# EAGLE design Feather-RTD (EAGLE 9.0.0)
LICENSE: CC BY-SA 4.0; REV: XTMT; TITLE: Feather RTD Wing; URL: https://github.com/CapableRobot/Feather-RTD

## Sheet 1 of 3
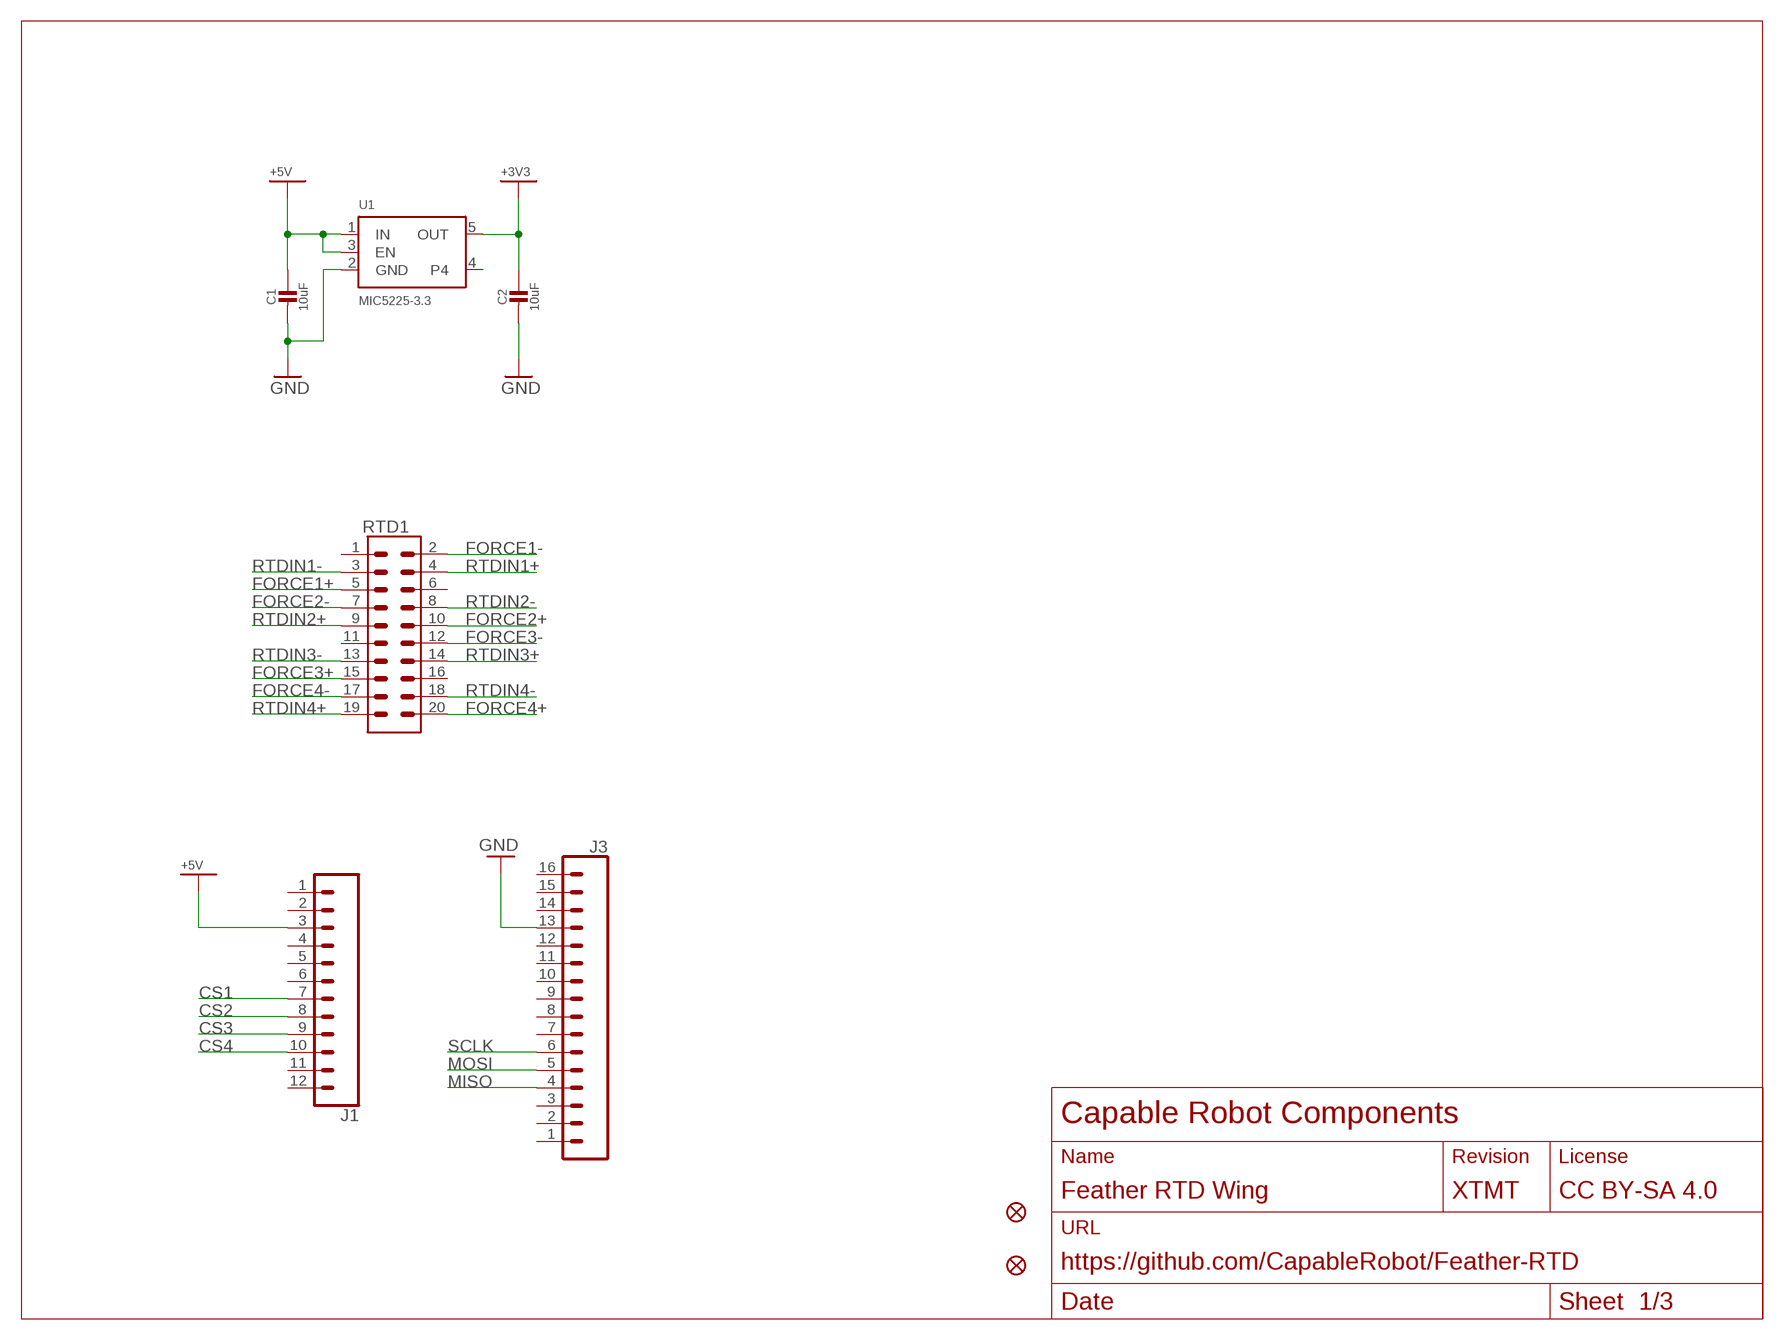
[diagram p0: schematic, sheet 1]

### Parts
C1  10uF  CAP_CERAMIC0805-NOOUTLINE  [0805-NO]
C2  10uF  CAP_CERAMIC0805-NOOUTLINE  [0805-NO]
FID1  FIDUCIAL""  [FIDUCIAL_1MM]
FID2  FIDUCIAL""  [FIDUCIAL_1MM]
J1  CONN_12NO_SILK  [1X12_NO_SILK]
J3  CONN_161X16_NO_SILK  [1X16_NO_SILK]
RTD1  CONN-20  [CONN-2X10-050-SMT-ZT]
U1  MIC5225-3.3  VREG_SOT23-5  [SOT23-5]

### Nets
+3V3: C2.1 U1.5(OUT) ; also sheet 2,3
+5V: C1.1 J1.3 U1.1(IN) U1.3(EN)
CS1: J1.7 ; also sheet 2
CS2: J1.8 ; also sheet 2
CS3: J1.9 ; also sheet 3
CS4: J1.10 ; also sheet 3
FORCE1+: RTD1.5 ; also sheet 2
FORCE1-: RTD1.2 ; also sheet 2
FORCE2+: RTD1.10 ; also sheet 2
FORCE2-: RTD1.7 ; also sheet 2
FORCE3+: RTD1.15 ; also sheet 3
FORCE3-: RTD1.12 ; also sheet 3
FORCE4+: RTD1.20 ; also sheet 3
FORCE4-: RTD1.17 ; also sheet 3
GND: C1.2 C2.2 J3.13 U1.2(GND) ; also sheet 2,3
MISO: J3.4 ; also sheet 2,3
MOSI: J3.5 ; also sheet 2,3
RTDIN1+: RTD1.4 ; also sheet 2
RTDIN1-: RTD1.3 ; also sheet 2
RTDIN2+: RTD1.9 ; also sheet 2
RTDIN2-: RTD1.8 ; also sheet 2
RTDIN3+: RTD1.14 ; also sheet 3
RTDIN3-: RTD1.13 ; also sheet 3
RTDIN4+: RTD1.19 ; also sheet 3
RTDIN4-: RTD1.18 ; also sheet 3
SCLK: J3.6 ; also sheet 2,3
Unconnected: J1.1 J1.2 J1.4 J1.5 J1.6 J1.11 J1.12 J3.1 J3.2 J3.3 J3.7 J3.8 J3.9 J3.10 J3.11 J3.12 J3.14 J3.15 J3.16 RTD1.1 RTD1.6 RTD1.11 RTD1.16 U1.4

## Sheet 2 of 3
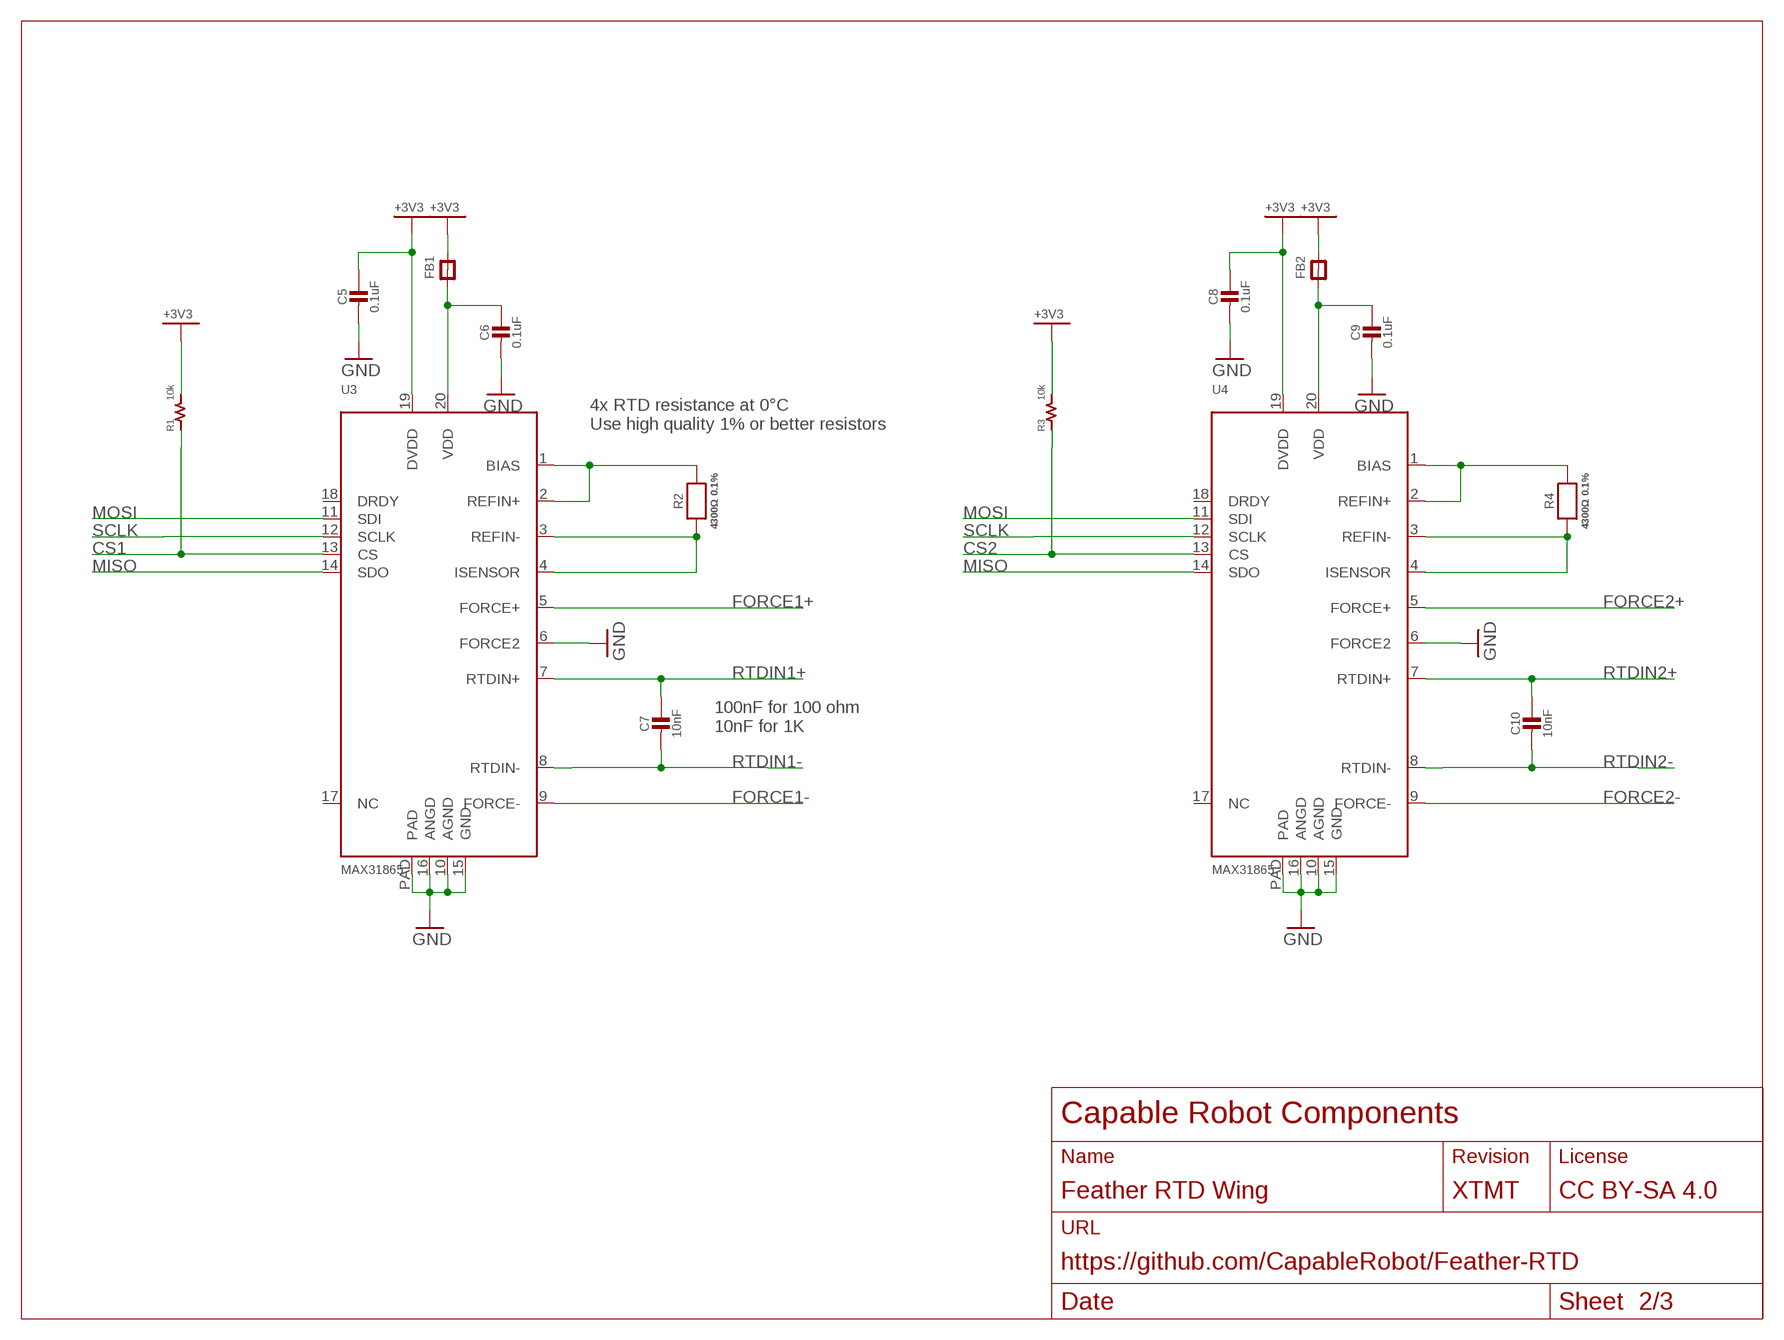
[diagram p1: schematic, sheet 2]

### Parts
C5  0.1uF  CAP_CERAMIC0805-NOOUTLINE  [0805-NO]
C6  0.1uF  CAP_CERAMIC0805-NOOUTLINE  [0805-NO]
C7  10nF  CAP_CERAMIC0805-NOOUTLINE  [0805-NO]
C8  0.1uF  CAP_CERAMIC0805-NOOUTLINE  [0805-NO]
C9  0.1uF  CAP_CERAMIC0805-NOOUTLINE  [0805-NO]
C10  10nF  CAP_CERAMIC0805-NOOUTLINE  [0805-NO]
FB1  FERRITE-0805NO  [0805-NO]
FB2  FERRITE-0805NO  [0805-NO]
R1  10k  RES0603  [0603]
R2  4300Ω 0.1%  RESISTOR0805_NOOUTLINE  [0805-NO]
R3  10k  RES0603  [0603]
R4  4300Ω 0.1%  RESISTOR0805_NOOUTLINE  [0805-NO]
U3  MAX31865  TEMP_MAX31865  [QFN20_4MM_0.65MM]
U4  MAX31865  TEMP_MAX31865  [QFN20_4MM_0.65MM]

### Nets
+3V3: C5.1 C8.1 FB1.2 FB2.2 R1.2 R3.2 U3.19(DVDD) U4.19(DVDD) ; also sheet 1,3
CS1: R1.1 U3.13(CS) ; also sheet 1
CS2: R3.1 U4.13(CS) ; also sheet 1
FORCE1+: U3.5(FORCE+) ; also sheet 1
FORCE1-: U3.9(FORCE-) ; also sheet 1
FORCE2+: U4.5(FORCE+) ; also sheet 1
FORCE2-: U4.9(FORCE-) ; also sheet 1
GND: C5.2 C6.2 C8.2 C9.2 U3.6(FORCE2) U3.10(AGND) U3.15(GND) U3.16(ANGD) U3.PAD U4.6(FORCE2) U4.10(AGND) U4.15(GND) U4.16(ANGD) U4.PAD ; also sheet 1,3
MISO: U3.14(SDO) U4.14(SDO) ; also sheet 1,3
MOSI: U3.11(SDI) U4.11(SDI) ; also sheet 1,3
N$5: R2.2 U3.1(BIAS) U3.2(REFIN+)
N$6: R2.1 U3.3(REFIN-) U3.4(ISENSOR)
N$7: C6.1 FB1.1 U3.20(VDD)
N$8: R4.2 U4.1(BIAS) U4.2(REFIN+)
N$9: R4.1 U4.3(REFIN-) U4.4(ISENSOR)
N$10: C9.1 FB2.1 U4.20(VDD)
RTDIN1+: C7.1 U3.7(RTDIN+) ; also sheet 1
RTDIN1-: C7.2 U3.8(RTDIN-) ; also sheet 1
RTDIN2+: C10.1 U4.7(RTDIN+) ; also sheet 1
RTDIN2-: C10.2 U4.8(RTDIN-) ; also sheet 1
SCLK: U3.12(SCLK) U4.12(SCLK) ; also sheet 1,3
Unconnected: U3.17(NC) U3.18(DRDY) U4.17(NC) U4.18(DRDY)

### Notes on the sheet
- 4x RTD resistance at 0°C 
  Use high quality 1% or better resistors
- 100nF for 100 ohm
  10nF for 1K

## Sheet 3 of 3
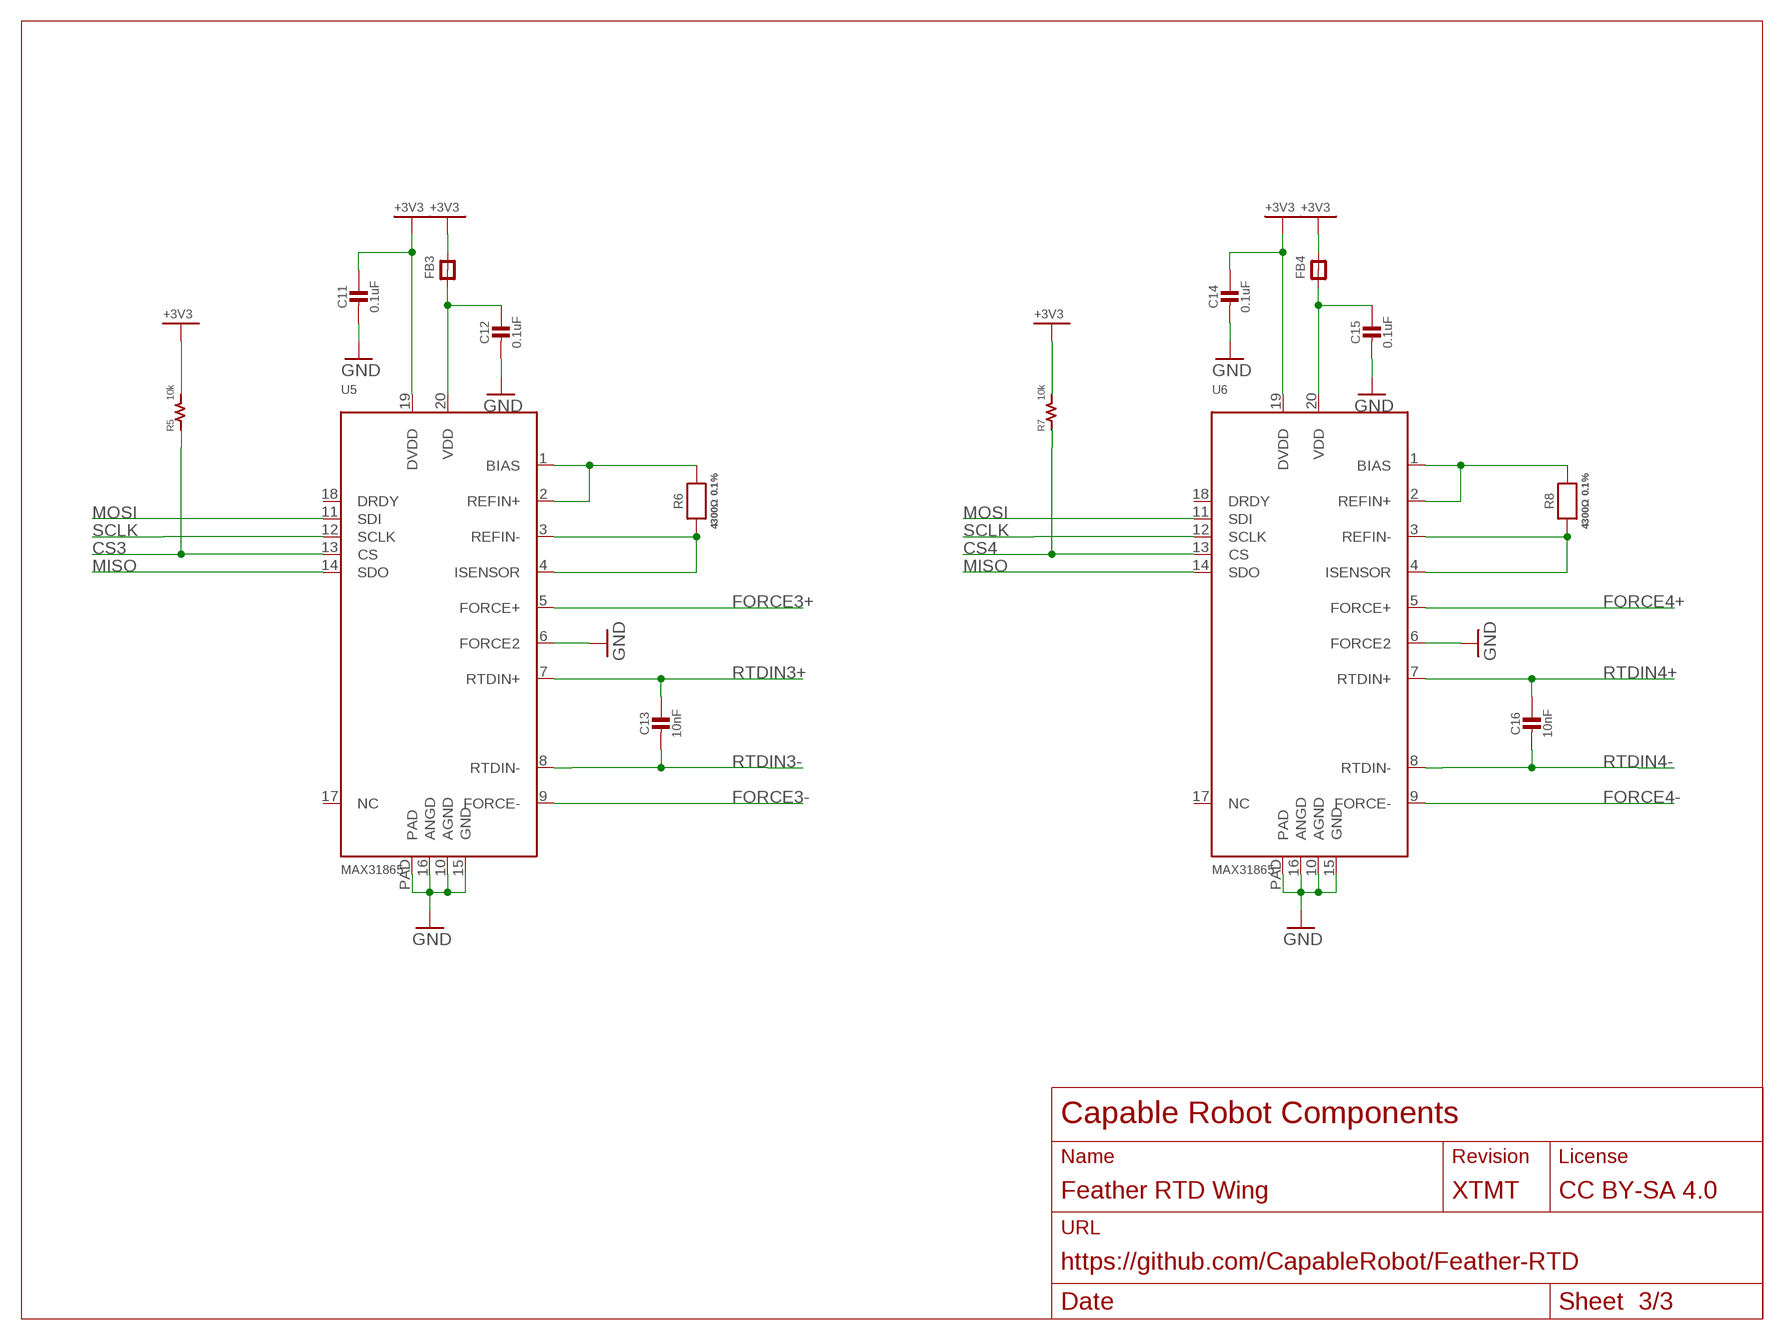
[diagram p2: schematic, sheet 3]

### Parts
C11  0.1uF  CAP_CERAMIC0805-NOOUTLINE  [0805-NO]
C12  0.1uF  CAP_CERAMIC0805-NOOUTLINE  [0805-NO]
C13  10nF  CAP_CERAMIC0805-NOOUTLINE  [0805-NO]
C14  0.1uF  CAP_CERAMIC0805-NOOUTLINE  [0805-NO]
C15  0.1uF  CAP_CERAMIC0805-NOOUTLINE  [0805-NO]
C16  10nF  CAP_CERAMIC0805-NOOUTLINE  [0805-NO]
FB3  FERRITE-0805NO  [0805-NO]
FB4  FERRITE-0805NO  [0805-NO]
R5  10k  RES0603  [0603]
R6  4300Ω 0.1%  RESISTOR0805_NOOUTLINE  [0805-NO]
R7  10k  RES0603  [0603]
R8  4300Ω 0.1%  RESISTOR0805_NOOUTLINE  [0805-NO]
U5  MAX31865  TEMP_MAX31865  [QFN20_4MM_0.65MM]
U6  MAX31865  TEMP_MAX31865  [QFN20_4MM_0.65MM]

### Nets
+3V3: C11.1 C14.1 FB3.2 FB4.2 R5.2 R7.2 U5.19(DVDD) U6.19(DVDD) ; also sheet 1,2
CS3: R5.1 U5.13(CS) ; also sheet 1
CS4: R7.1 U6.13(CS) ; also sheet 1
FORCE3+: U5.5(FORCE+) ; also sheet 1
FORCE3-: U5.9(FORCE-) ; also sheet 1
FORCE4+: U6.5(FORCE+) ; also sheet 1
FORCE4-: U6.9(FORCE-) ; also sheet 1
GND: C11.2 C12.2 C14.2 C15.2 U5.6(FORCE2) U5.10(AGND) U5.15(GND) U5.16(ANGD) U5.PAD U6.6(FORCE2) U6.10(AGND) U6.15(GND) U6.16(ANGD) U6.PAD ; also sheet 1,2
MISO: U5.14(SDO) U6.14(SDO) ; also sheet 1,2
MOSI: U5.11(SDI) U6.11(SDI) ; also sheet 1,2
N$11: R6.2 U5.1(BIAS) U5.2(REFIN+)
N$12: R6.1 U5.3(REFIN-) U5.4(ISENSOR)
N$13: C12.1 FB3.1 U5.20(VDD)
N$14: R8.2 U6.1(BIAS) U6.2(REFIN+)
N$15: R8.1 U6.3(REFIN-) U6.4(ISENSOR)
N$16: C15.1 FB4.1 U6.20(VDD)
RTDIN3+: C13.1 U5.7(RTDIN+) ; also sheet 1
RTDIN3-: C13.2 U5.8(RTDIN-) ; also sheet 1
RTDIN4+: C16.1 U6.7(RTDIN+) ; also sheet 1
RTDIN4-: C16.2 U6.8(RTDIN-) ; also sheet 1
SCLK: U5.12(SCLK) U6.12(SCLK) ; also sheet 1,2
Unconnected: U5.17(NC) U5.18(DRDY) U6.17(NC) U6.18(DRDY)

## Library data of the parts
C1 C2 C5-C16 = microbuilder:CAP_CERAMIC: Ceramic Capacitors For new designs, use the packages preceded by an '_' character since they are more reliable: The following footprints should be used on most boards: _0402 - Standard footprint for regular board layouts _0603 - Standard footprint for regular board layouts _0805 - Standard footprint for regular board layouts _1206 - Standard footprint for regular board layouts For extremely tight-pitch boards where space is at a premium, the following 'micro-pitch' footprints can be used (smaller pads, no silkscreen outline, etc.): _0402MP - Micro-pitch footprint for very dense/compact boards _0603MP - Micro-pitch footprint for very dense/compact boards _0805MP - Micro-pitch footprint for very dense/compact boards _1206MP - Micro-pitch footprint for very dense/compact boards
FB1-FB4 = microbuilder:FERRITE: Ferrite Bead 0603 MMZ1608B121C - 120 Ohm @ 100MHz, 600mA, 0.15 Ohm DC Resistance - Digikey: 445-2164-1-ND BK1608HW121-T - 120 Ohm, 600mA Ferrite Chip - Digikey: 587-1876-2-ND 0805 HZ0805B272R-10 - 2.7K Ohm @ 100MHz, 200mA, 0.8 Ohm DC Resistance - Digikey: 240-2504-1-ND (see also Murata BLM21BD272SN1L) MMZ2012Y152B - 1.5K Ohm @ 100MHz, 500mA, 0.4 Ohm DC Resistance - Digikey: 445-1560-1-ND - Mainly for high frequency (80-400MHz) MMZ2012R102A - 1K Ohm @ 100MHz, 500mA, 0.3 Ohm DC Resistance - Digikey: 445-1555-2-ND - More general purpose (10-200MHz)
FID1 FID2 = microbuilder:FIDUCIAL: Fiducial Alignment Points Various fiducial points for machine vision alignment.; BOM: EXCLUDE
J1 = SparkFun-Connectors:CONN_12: Multi connection point. Often used as Generic Header-pin footprint for 0.1 inch spaced/style header connections On any of the 0.1 inch spaced packages, you can populate with these: Break Away Headers - Straight <https://www.sparkfun.com/products/116> (PRT-00116) Break Away Male Headers - Right Angle <https://www.sparkfun.com/products/553> (PRT-00553) Female Headers <https://www.sparkfun.com/products/115> (PRT-00115) Break Away Headers - Machine Pin <https://www.sparkfun.com/products/117> (PRT-00117) Break Away Female Headers - Swiss Machine Pin <https://www.sparkfun.com/products/743> (PRT-00743) For SCREWTERMINALS and SPRING TERMINALS visit here: Screw Terimnals on SparkFun.com <https://www.sparkfun.com/search/results?term=Screw+Terminals> (5mm/3.5mm/2.54mm spacing) This device is also useful as a general connection point to wire up your design to another part of your project. Our various solder wires solder well into these plated through hole pads. Hook-Up Wire - Assortment (Stranded, 22 AWG) <https://www.sparkfun.com/products/11375> (PRT-11375) Hook-Up Wire - Assortment (Solid Core, 22 AWG) <https://www.sparkfun.com/products/11367> (PRT-11367) View the entire wire category on our website here <https://www.sparkfun.com/categories/141> Special notes: Molex polarized connector foot print use with SKU : PRT-08231 with associated crimp pins and housings. 1MM SMD Version SKU: PRT-10208 NOTES ON THE VARIANTS LOCK and LOCK_LONGPADS... This footprint was designed to help hold the alignment of a through-hole component (i.e. 6-pin header) while soldering it into place. You may notice that each hole has been shifted either up or down by 0.005 of an inch from it's more standard position (which is a perfectly straight line). This slight alteration caused the pins (the squares in the middle) to touch the edges of the holes. Because they are alternating, it causes a "brace" to hold the component in place. 0.005 has proven to be the perfect amount of "off-center" position when using our standard breakaway headers. Although looks a little odd when you look at the bare footprint, once you have a header in there, the alteration is very hard to notice. Also,if you push a header all the way into place, it is covered up entirely on the bottom side.
J3 = SparkFun-Connectors:CONN_16: Multi connection point. Often used as Generic Header-pin footprint for 0.1 inch spaced/style header connections On any of the 0.1 inch spaced packages, you can populate with these: Break Away Headers - Straight <https://www.sparkfun.com/products/116> (PRT-00116) Break Away Male Headers - Right Angle <https://www.sparkfun.com/products/553> (PRT-00553) Female Headers <https://www.sparkfun.com/products/115> (PRT-00115) Break Away Headers - Machine Pin <https://www.sparkfun.com/products/117> (PRT-00117) Break Away Female Headers - Swiss Machine Pin <https://www.sparkfun.com/products/743> (PRT-00743) For SCREWTERMINALS and SPRING TERMINALS visit here: Screw Terimnals on SparkFun.com <https://www.sparkfun.com/search/results?term=Screw+Terminals> (5mm/3.5mm/2.54mm spacing) This device is also useful as a general connection point to wire up your design to another part of your project. Our various solder wires solder well into these plated through hole pads. Hook-Up Wire - Assortment (Stranded, 22 AWG) <https://www.sparkfun.com/products/11375> (PRT-11375) Hook-Up Wire - Assortment (Solid Core, 22 AWG) <https://www.sparkfun.com/products/11367> (PRT-11367) View the entire wire category on our website here <https://www.sparkfun.com/categories/141> Special notes: Molex polarized connector foot print use with SKU : PRT-08231 with associated crimp pins and housings. 1MM SMD Version SKU: PRT-10208 NOTES ON THE VARIANTS LOCK and LOCK_LONGPADS... This footprint was designed to help hold the alignment of a through-hole component (i.e. 6-pin header) while soldering it into place. You may notice that each hole has been shifted either up or down by 0.005 of an inch from it's more standard position (which is a perfectly straight line). This slight alteration caused the pins (the squares in the middle) to touch the edges of the holes. Because they are alternating, it causes a "brace" to hold the component in place. 0.005 has proven to be the perfect amount of "off-center" position when using our standard breakaway headers. Although looks a little odd when you look at the bare footprint, once you have a header in there, the alteration is very hard to notice. Also,if you push a header all the way into place, it is covered up entirely on the bottom side.
R1 R3 R5 R7 = CapableRobot:RES
R2 R4 R6 R8 = microbuilder:RESISTOR: Resistors For new designs, use the packages preceded by an '_' character since they are more reliable: The following footprints should be used on most boards: _0402 - Standard footprint for regular board layouts _0603 - Standard footprint for regular board layouts _0805 - Standard footprint for regular board layouts _1206 - Standard footprint for regular board layouts For extremely tight-pitch boards where space is at a premium, the following 'micro-pitch' footprints can be used (smaller pads, no silkscreen outline, etc.): _0402MP - Micro-pitch footprint for very dense/compact boards _0603MP - Micro-pitch footprint for very dense/compact boards _0805MP - Micro-pitch footprint for very dense/compact boards _1206MP - Micro-pitch footprint for very dense/compact boards
RTD1 = osterwood:CONN-20
U1 = microbuilder:VREG_SOT23-5: SOT23-5 Fixed Voltage Regulators Part Current Out V Out V In V Dropout θJA (°C/W) TJ (°C) Digikey Part No. ADP121 150mA 3.3V 3.4-5.5V 0.09V @ 150mA -- -- ADP121-AUJZ33R7CT-ND ADP121 150mA 3.0V 3.1-5.5V 0.09V @ 150mA -- -- ADP121-AUJZ30R7CT-ND ADP122 300mA 3.3V 3.4-5.5V 0.085V @ 300mA -- -- ADP122AUJZ-3.3-R7CT-ND ADP1712 300mA 3.3V 3.5-5.5V 0.17V @ 300mA -- -- ADP1712AUJZ-3.3-R7TR-ND AP7311 (Low Cost) 150mA 3.3V 3.5-6V 0.15V @ 150mA -- -- AP7311-33WG-7DICT-ND LD39015M18R 150mA 1.8V 1.9V-5.5V 0.08V @ 100mA -- -- 497-6977-1-ND LP2985A-33DBVR 150mA 3.3V 3.3-16V 0.28V @ 150mA 206 150 296-18479-1-ND MCP1824T-3302E/OT 300mA 3.3V 3.5V-6V 0.2V @ 300mA -- -- MCP1824T-3302E/OTCT-ND MIC5205-2.5YM5 TR 150mA 2.5V 2.7-16V 0.165V @ 150mA -- -- 576-1257-2-ND MIC5205-3.0YM5 TR 150mA 3.0V 3.2V-16V 0.165V @ 150mA -- -- 576-1258-2-ND MIC5205-3.3YM5 TR 150mA 3.3V 3.5V-16V 0.165V @ 150mA -- -- 576-1259-2-ND TPS780330220 150mA 3.3V+2.2V 3.6-5.5V 250mV Max -- -- 296-23332-1-ND TDA3663/N1,135 100mA 3.3V 3.5-45V 0.18V @ 50mA -- -- 568-5343-1-ND Max operating temp can be calculated using θJA, TJ (max junction temperature), and power in watts. Set the "Maximum Ambient Temperature" until it reaches TJ ("Max Junction Temperature"), which is the absolute limit for safe use of the regulator: Heat Sink Temperature Calculator <http://www.daycounter.com/Calculators/Heat-Sink-Temperature-Calculator.phtml> For example, With 12V source into a 3.3V LP2985 and a 30mA load, we are dissipating (12V-3.3V) * 0.03A = 0.261W. With a θJA of 206 °C/W, a TJ of 150°C, and 261mW we can safely use the chip without a heat sink up to 75°C (=147.1°C Junction Temperature).
U3-U6 = microbuilder:TEMP_MAX31865: MAX31865 - Resistance to Digital Convertor for Platinum Resistance Temperature Detectors (RTDs) Handles 100 ohm - 1K ohm (at 0°C) platinum RTDs. 15-bit ADC resolution (nominally 0.03125°C), 0.5°C accuracy.

## Board
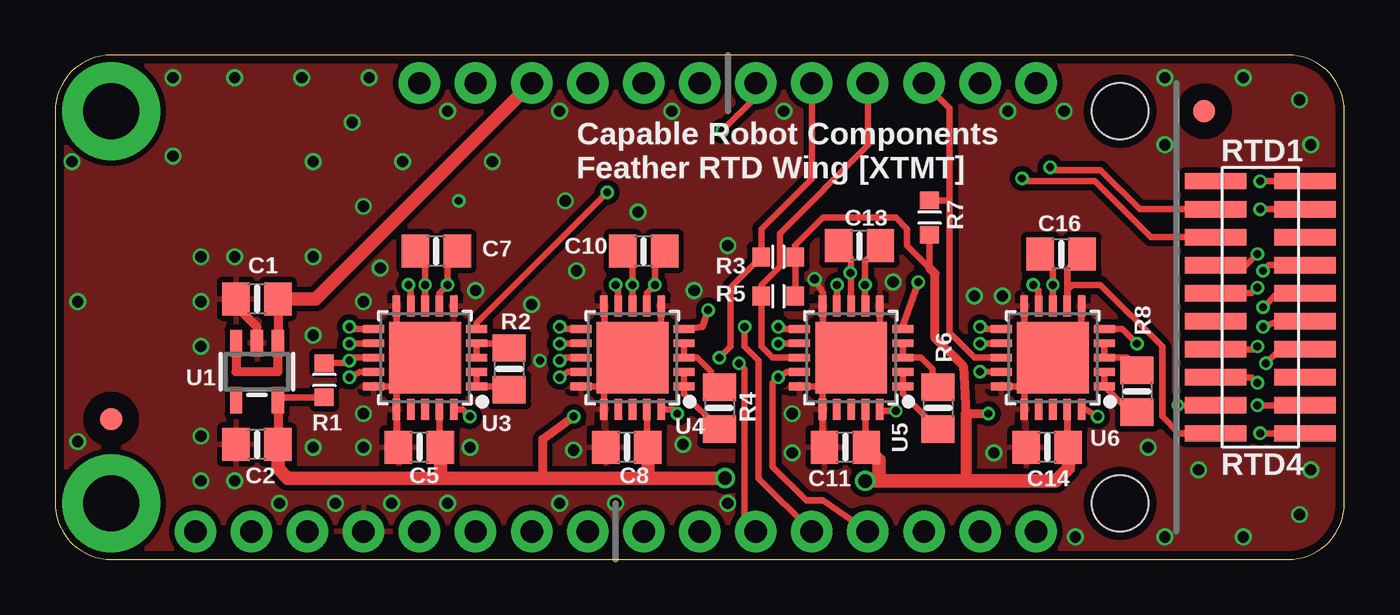
[diagram p3: board, top side]
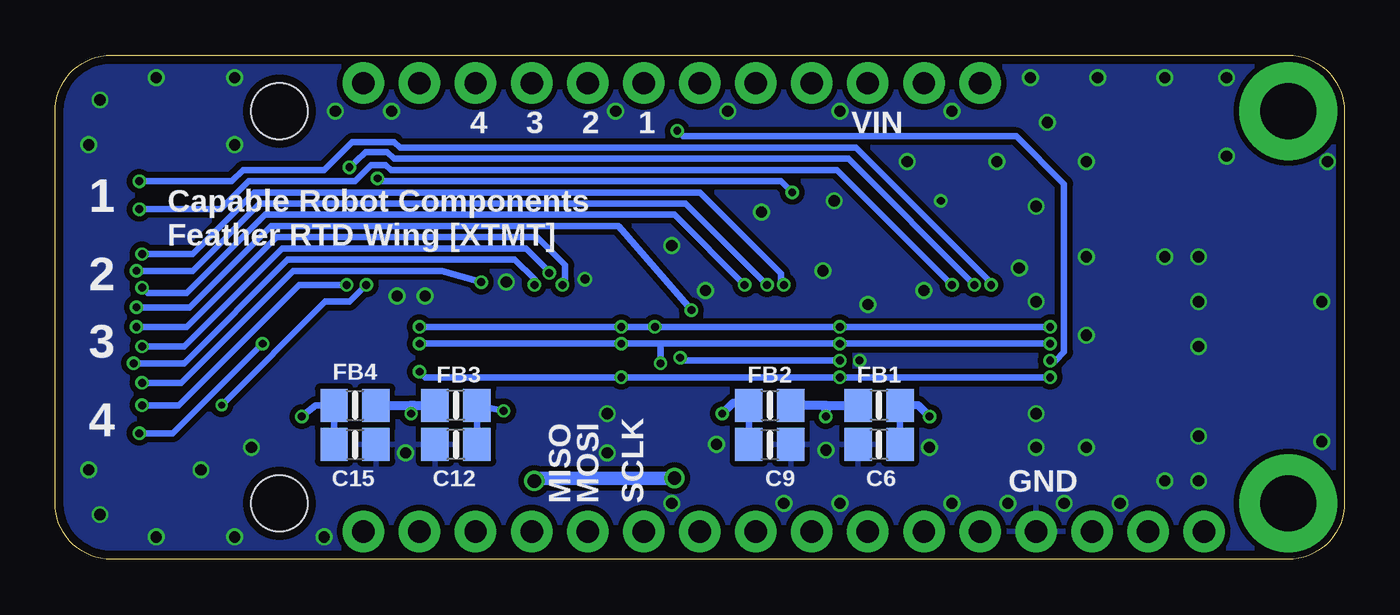
[diagram p4: board, bottom side, seen from below]

Size 58.42 x 22.86 mm. Coordinates in mm from the lower left corner, seen from the top.
Outline: 2.54,0 55.88,0 arc90 58.42,2.54 58.42,20.32 arc90 55.88,22.86 2.54,22.86 arc90 0,20.32 0,2.54 arc90 2.54,0
Copper layers (1*16): Top 0.035559375mm / dielectric 1.6mm / Bottom 0.035559375mm
Design rules "oshpark-2layer-tented *": minimum track width 6mil, minimum drill 10mil, track to track 6mil, track to pad 6mil, pad to pad 6mil, via to via 6mil, smd to smd 6mil, copper to edge 15mil, drill to drill 6mil, minimum pad ring 5mil, minimum via ring 5mil, stop-mask expansion 2.5mil, vias tented up to drill 25mil, thermal gap 10mil
Holes 2.54 mm at 48.26,2.54 48.26,20.32

### Footprints (pad centres in the part's own frame; a part is rotated, then mirrored left to right if it is on the bottom)
0805-NO = smd 1.24 x 1.5: 1 -0.95,0; 2 0.95,0
FIDUCIAL_1MM = smd 1 x 1: 1 0,0
1X12_NO_SILK = drill 1.016 pad 1.88: 1 0,0; 2 2.54,0; 3 5.08,0; 4 7.62,0; 5 10.16,0; 6 12.7,0; 7 15.24,0; 8 17.78,0; 9 20.32,0; 10 22.86,0; 11 25.4,0; 12 27.94,0
1X16_NO_SILK = drill 1.016 pad 1.88: 1 0,0; 2 2.54,0; 3 5.08,0; 4 7.62,0; 5 10.16,0; 6 12.7,0; 7 15.24,0; 8 17.78,0; 9 20.32,0; 10 22.86,0; 11 25.4,0; 12 27.94,0; 13 30.48,0; 14 33.02,0; 15 35.56,0; 16 38.1,0
0603 = smd 0.79 x 0.86: 1 -0.775,0; 2 0.775,0
CONN-2X10-050-SMT-ZT = smd 0.737 x 2.794: 1 5.715,2.032; 2 5.715,-2.032; 3 4.445,2.032; 4 4.445,-2.032; 5 3.175,2.032; 6 3.175,-2.032; 7 1.905,2.032; 8 1.905,-2.032; 9 0.635,2.032; 10 0.635,-2.032; 11 -0.635,2.032; 12 -0.635,-2.032; 13 -1.905,2.032; 14 -1.905,-2.032; 15 -3.175,2.032; 16 -3.175,-2.032; 17 -4.445,2.032; 18 -4.445,-2.032; 19 -5.715,2.032; 20 -5.715,-2.032
SOT23-5 = smd 0.55 x 1.2: 1 -0.95,-1.3; 2 0,-1.3; 3 0.95,-1.3; 4 0.95,1.3; 5 -0.95,1.3
QFN20_4MM_0.65MM = smd 0.35 x 0.95: 1 -1.3,-2.34; 2 -0.65,-2.34; 3 0,-2.34; 4 0.65,-2.34; 5 1.3,-2.34; 11 1.3,2.34; 12 0.65,2.34; 13 0,2.34; 14 -0.65,2.34; 15 -1.3,2.34 | smd 0.95 x 0.35: 6 2.34,-1.3; 7 2.34,-0.65; 8 2.34,0; 9 2.34,0.65; 10 2.34,1.3; 16 -2.34,1.3; 17 -2.34,0.65; 18 -2.34,0; 19 -2.34,-0.65; 20 -2.34,-1.3 | smd 3.25 x 3.25: PAD 0,0

### Placement (x,y rotation side)
C1  9.14,11.81 180 top
C2  9.14,5.21 180 top
C5  16.51,5.08 180 top
C6  21.08,5.21 180 bottom
C7  17.27,13.97 180 top
C8  25.91,5.08 180 top
C9  26.04,5.21 0 bottom
C10  26.67,13.97 180 top
C11  35.81,5.08 180 top
C12  40.26,5.21 180 bottom
C13  36.45,14.22 180 top
C14  44.96,5.08 180 top
C15  44.83,5.21 0 bottom
C16  45.59,13.84 180 top
FB1  21.08,6.99 180 bottom
FB2  26.04,6.99 0 bottom
FB3  40.26,6.99 180 bottom
FB4  44.83,6.99 0 bottom
FID1  2.54,6.35 90 top
FID2  52.07,20.32 90 top
J1  16.51,21.59 0 top
J3  44.45,1.27 180 top
R1  12.19,8.13 270 top
R2  20.57,8.64 270 top
R3  32.77,13.72 0 top
R4  30.1,6.86 270 top
R5  32.77,11.94 0 top
R6  40.01,6.86 270 top
R7  39.62,15.49 270 top
R8  49.02,7.62 270 top
RTD1  54.61,11.43 90 top
U1  9.14,8.51 180 top
U3  16.76,9.14 90 top
U4  26.16,9.14 90 top
U5  36.07,9.14 90 top
U6  45.21,9.14 90 top

### Tracks (layer width: path | path; a pad name or v marks a point on that pad's centre or on a via)
+3V3  (via drill 0.36, 0.61)
  Top 0.305: U4.19 26.81,5.13 C8.1 | U3.19 17.41,5.13 C5.1 | 12.05,7.21 R1.2 10.24,7.35 U1.5 | R3.2 33.49,13.77 R3.2 | U6.19 45.86,5.13 C14.1 | U5.19 36.72,5.13 C11.1 37.27,4.57 | R5.2 R3.2 | R7.2 39.62,13.21 38.61,14.22 38.61,14.99 38.1,15.49 34.8,15.49 33.53,14.22 33.54,14.21 R3.2
  Top 0.406: U1.5 C2.1 | 39.62,13.21 39.88,12.95 39.88,10.03 41.15,8.76 41.27,6.6 v42.29,6.6 | 22.1,3.68 22.1,5.46 v23.5,6.48
  Top 0.508: 41.27,6.6 41.27,3.56
  Top 0.61: 17.46,3.68 20.07,3.68 22.1,3.68 26.92,3.68 | 26.92,3.68 v30.35,3.68 | 37.34,3.56 v36.7,3.56 36.76,3.62 | 37.34,3.56 38.23,3.56 41.27,3.56 45.34,3.56 45.91,4.12 C14.1 | 26.92,3.68 26.86,3.75 C8.1 | 17.46,3.68 10.54,3.68 10.09,4.13 C2.1 | C5.1 17.46,3.68 | C11.1 37.34,4.51 37.34,3.56
  Bottom 0.406: 23.5,6.99 v23.5,6.48 23.5,6.99 | FB4.2 42.29,6.99 | 42.29,6.99 v42.29,6.6 | v42.29,6.6 42.29,6.99 | 23.5,6.99 FB1.2 | 23.5,6.99 FB2.2 | v42.29,6.6 42.16,6.99 FB3.2
  Bottom 0.61: v30.35,3.68 36.58,3.68 v36.7,3.56
+5V
  Top 0.406: 9.91,12 C1.1 U1.1 10.09,8.51 8.19,8.51 U1.3
  Top 0.61: C1.1 11.81,11.81 J1.3
CS1  (via drill 0.36)
  Top 0.305: U3.13 13.46,9.14 v13.34,9.02 13.22,8.9 R1.1 | v30.23,19.43 31.75,20.95 J1.7
  Bottom 0.305: v13.34,9.02 13.08,9.02 12.7,9.4 12.7,17.02 14.86,19.18 29.97,19.18 v30.23,19.43
CS2  (via drill 0.36)
  Top 0.305: v22.86,9.02 23.11,9.14 U4.13 | v30.1,9.14 30.61,9.65 30.61,12.33 32,13.73 | 31.99,13.96 R3.1 32,13.73 | J1.8 34.29,17.27 32,14.99 32,13.73
  Bottom 0.305: v22.86,9.02 29.84,9.02 v30.1,9.14
CS3
  Top 0.305: 33.7,9.12 U5.13 32.51,9.14 32,9.65 32,12.45 | R5.1 32,11.95 32,12.45 | J1.9 36.83,18.77 32.84,14.78 32.84,13.28 32,12.45
CS4
  Top 0.305: 40.51,16.26 40.51,10.29 41.66,9.14 U6.13 | R7.1 39.64,16.26 40.51,16.26 | J1.10 40.51,20.45 40.51,16.26
FORCE1+  (via drill 0.36)
  Top 0.305: U3.5 19.1,10.72 v25.02,16.64 | v43.81,17.27 43.94,17.27 44.07,17.14 47.12,17.14 49.66,14.61 RTD1.5
  Bottom 0.305: v25.02,16.64 25.53,17.14 43.69,17.14 v43.81,17.27
FORCE1-  (via drill 0.36)
  Top 0.305: U3.9 16.11,12.21 v16,12.45 | v54.61,17.14 RTD1.2
  Bottom 0.305: v16,12.45 16.15,12.6 16.15,12.7 22.12,18.67 42.8,18.67 43.05,18.92 44.96,18.92 46.23,17.65 49.91,17.65 50.42,17.14 v54.61,17.14
FORCE2+  (via drill 0.36)
  Top 0.305: v54.74,11.43 55.37,12.06 RTD1.10 | v29.59,11.3 29.34,10.54 U4.5
  Bottom 0.305: v54.74,11.43 52.32,11.43 48.64,15.11 32.89,15.11 v29.59,11.3
FORCE2-  (via drill 0.36)
  Top 0.305: U4.9 25.51,12.33 v25.4,12.45 | v54.48,13.84 53.98,13.34 RTD1.7
  Bottom 0.305: v25.4,12.45 25.53,12.57 25.53,12.95 29.21,16.64 47.62,16.64 | 47.62,16.64 47.88,16.64 | 47.62,16.64 49.4,16.64 52.2,13.84 v54.48,13.84
FORCE3+  (via drill 0.36)
  Top 0.305: U5.5 38.41,10.6 v39.12,12.57 | v54.48,8 54.23,8.26 RTD1.15
  Bottom 0.305: v54.48,8 52.7,8 47.62,13.08 40.89,13.08 v39.12,12.57
FORCE3-  (via drill 0.36)
  Top 0.305: U5.9 35.43,11.5 v35.43,12.45 | v54.74,10.54 55.37,10.79 RTD1.12
  Bottom 0.305: v35.43,12.45 35.43,12.57 35.31,12.7 35.31,13.34 35.81,13.84 36.58,14.61 48.39,14.61 52.45,10.54 v54.74,10.54
FORCE4+  (via drill 0.36)
  Top 0.305: U6.5 48.36,10.44 v49.02,9.78 | v54.61,5.71 RTD1.20
  Bottom 0.305: v49.02,9.78 53.09,5.71 v54.61,5.71
FORCE4-  (via drill 0.3, 0.36)
  Top 0.305: U6.9 44.56,12.21 v44.32,12.45 | v50.88,6.99 RTD1.17
  Bottom 0.305: v50.88,6.99 46.18,11.68 45.09,11.68 v44.32,12.45
GND  (via drill 0.36, 0.41, 0.51)
  Top 0.305: 24.86,5.18 C8.2 | U4.16 24.86,7.84 | 24.86,7.84 24.89,7.87 24.86,7.84 | 24.86,7.84 U4.15 | U4.10 24.89,11.45 24.89,10.29 26.04,9.14 U4.PAD | 15.46,5.18 U3.16 15.46,7.84 | 18.06,10.44 U3.PAD | 15.46,7.84 U3.PAD | U3.10 15.46,10.44 U3.PAD | U3.15 15.46,7.84 | 15.46,7.84 U3.PAD | U4.6 27.46,10.44 27.43,10.41 | U5.10 34.8,11.45 34.8,11.18 | 34.8,11.18 34.8,10.41 | 34.77,7.84 U5.16 34.77,5.18 | 34.77,7.84 34.8,7.87 | U5.15 34.77,7.84 | v34.42,12.7 34.8,12.06 34.8,11.18 | U5.6 37.37,10.44 | U6.6 46.51,10.92 46.51,10.44 | 43.94,11.45 U6.10 43.91,10.44 U6.PAD | U6.15 43.91,7.84 | 43.91,7.84 U6.PAD | U6.16 43.91,7.84 | 43.91,7.84 U6.PAD | 43.91,5.18 C14.2
  Top 0.406: U1.2 9.14,10.54 8.19,11.49 C1.2 | U6.PAD 46.51,10.44 | U5.PAD 34.77,7.84
  other vias: 17.78,20.32 11.68,13.72 8.13,13.72 6.6,13.72 6.6,11.68 6.6,9.65 6.6,3.56 8.13,3.56 6.6,5.59 11.68,5.08 11.68,10.16 13.97,6.6 13.97,5.08 10.16,2.54 12.7,2.54 15.24,2.54 17.78,2.54 22.86,2.54 25.4,2.54 33.4,6.6 41.66,11.94 42.93,11.94 43.18,20.32 45.72,20.32 56.9,18.8 56.39,20.83 50.29,21.84 53.85,21.84 56.9,4.06 56.39,2.03 50.29,1.02 53.85,1.02 13.97,16 14.22,21.84 11.18,21.84 8.13,21.84 5.33,18.29 0.76,18.03 1.02,11.68 1.02,5.33 21.97,9.02 23.5,4.95 18.8,5.08 28.45,5.21 30.48,2.54 33.4,4.83 42.55,4.83 46.23,1.02 49.53,5.08 51.82,4.06 50.29,18.8 37.97,12.57 30.48,14.22 28.96,12.19 26.42,15.75 23.11,16.26 19.05,12.19 21.59,11.56 18.29,16.26 19.81,18.03 14.73,13.21 13.97,11.68 15.75,18.03 23.62,13.08 11.68,18.03 13.46,19.81 22.86,20.32 27.94,20.32 5.33,21.84 33.02,20.32
  pour Top (isolate 0.254): 0,0 60.96,0 60.96,22.86 0,22.86
  pour Bottom (isolate 0.254): 0,0 58.42,0 58.42,25.4 0,25.4
MISO  (via drill 0.36)
  Top 0.305: U6.14 42.43,8.49 v41.91,8.51 | U5.14 33.16,8.49 v32.77,8.26 32.51,8 32.51,4.19 34.04,2.67 34.8,2.67 J3.4 | U3.14 13.83,8.49 v13.34,8.26 | U4.14 23.23,8.49 v22.86,8.26
  Bottom 0.305: v41.91,8.51 41.66,8.26 36.83,8.26 v32.77,8.26 v22.86,8.26 v13.34,8.26
MOSI  (via drill 0.36)
  Top 0.305: U6.11 42.13,10.44 v41.91,10.54 41.78,10.54 | U5.11 32.99,10.44 v32.77,10.54 | U3.11 13.43,10.44 v13.34,10.54 | U4.11 22.96,10.44 v22.86,10.54 | J3.5 31.88,3.68 31.88,9.02 31.24,9.65 v31.24,10.54
  Bottom 0.305: v41.91,10.54 v32.77,10.54 v31.24,10.54 v22.86,10.54 v13.34,10.54
N$1  (via drill 2.54 pad 4.45)
  other vias: 2.54,2.54
N$2  (via drill 2.54 pad 4.45)
  other vias: 2.54,20.32
N$5
  Top 0.305: U3.2 U3.1 20.67,7.84 R2.2
N$6
  Top 0.305: U3.3 U3.4 20.62,9.79 R2.1
N$7  (via drill 0.36)
  Top 0.305: U3.20 18.47,6.8 v18.8,6.48
  Bottom 0.305: FB1.1 C6.1
  Bottom 0.356: v18.8,6.48 19.3,6.99 FB1.1
N$8
  Top 0.305: U4.2 U4.1 28.5,7.5 R4.2
N$9
  Top 0.305: U4.4 U4.3 29.08,9.14 29.72,8.51 29.72,8.19 R4.1
N$10  (via drill 0.36)
  Top 0.305: U4.20 27.99,6.8 v28.19,6.6
  Bottom 0.305: FB2.1 C9.1
  Bottom 0.356: v28.19,6.6 27.69,7.11 FB2.1
N$11
  Top 0.305: U5.2 U5.1 38.41,7.5 R6.2
N$12
  Top 0.305: R6.1 39.75,8.06 39.75,8.64 39.24,9.14 39.12,9.14 U5.3 U5.4 38.42,9.78
N$13  (via drill 0.36)
  Top 0.305: U5.20 37.44,6.73 v38.1,6.73
  Bottom 0.305: v38.1,6.73 FB3.1 C12.1
N$14
  Top 0.305: U6.2 U6.1 48.73,6.67 R8.2
N$15
  Top 0.305: U6.4 U6.3 48.58,9.14 R8.1
N$16  (via drill 0.36)
  Top 0.305: v47.24,6.48 46.57,6.86 U6.20
  Bottom 0.305: v47.24,6.48 46.61,6.99 FB4.1 C15.1
RTDIN1+  (via drill 0.36)
  Top 0.305: U3.7 17.41,12.08 v17.78,12.45 17.78,13.53 C7.1 | v54.61,15.88 RTD1.4
  Bottom 0.305: v17.78,12.45 22.99,17.65 43.21,17.65 43.44,17.88 44.09,17.88 44.83,17.14 49.66,17.14 50.93,15.88 v54.61,15.88
RTDIN1-  (via drill 0.36)
  Top 0.305: U3.8 v16.76,12.45 16.76,13.53 C7.2 | RTD1.3 49.15,15.88 47.37,17.65 45.21,17.65 v45.09,17.78
  Bottom 0.305: v16.76,12.45 22.48,18.16 26.04,18.16 | 26.04,18.16 26.42,18.16 | v45.09,17.78 44.4,18.41 44.35,18.47 43.37,18.47 43.07,18.16 26.04,18.16
RTDIN2+  (via drill 0.36)
  Top 0.305: U4.7 26.81,12.08 v27.18,12.45 27.18,13.4 C10.1 | v54.48,12.32 54.23,12.06 RTD1.9
  Bottom 0.305: v27.18,12.45 30.35,15.62 48.9,15.62 52.45,12.06 54.23,12.06 v54.48,12.32
RTDIN2-  (via drill 0.36)
  Top 0.305: U4.8 v26.16,12.45 26.16,13.65 C10.2 | v54.74,13.08 54.99,13.34 RTD1.8
  Bottom 0.305: v26.16,12.45 29.84,16.13 32.13,16.13 | 32.13,16.13 32.38,16.13 | v54.74,13.08 52.2,13.08 49.15,16.13 32.13,16.13
RTDIN3+  (via drill 0.36)
  Top 0.305: U5.7 36.7,11.5 v36.7,12.45 36.7,13.53 C13.1 | v54.86,8.89 55.5,9.53 RTD1.14
  Bottom 0.305: v54.86,8.89 52.58,8.89 47.88,13.59 39.37,13.59 37.59,13.59 36.7,12.7 v36.7,12.45
RTDIN3-  (via drill 0.36)
  Top 0.305: U5.8 36.07,12.83 | 36.07,12.83 v36.04,12.98 | v54.48,9.65 54.36,9.53 RTD1.13 | C13.2 36.07,13.65 36.07,12.83
  Bottom 0.305: v36.04,12.98 36.07,13.08 37.08,14.1 48.13,14.1 52.58,9.65 v54.48,9.65
RTDIN4+
  Top 0.305: U6.7 45.86,12.21 | 45.86,12.21 46.1,12.45 47.37,12.45 50.16,9.65 50.16,6.48 50.93,5.71 RTD1.19 | C16.1 45.86,13.16 45.86,12.21
RTDIN4-  (via drill 0.36)
  Top 0.305: RTD1.18 v54.48,6.99 | U6.8 v45.21,12.45 45.21,13.15 C16.2
  Bottom 0.305: v54.48,6.99 52.83,6.99 47.37,12.45 v45.21,12.45
SCLK  (via drill 0.36)
  Top 0.305: U6.12 42.05,9.79 v41.91,9.78 | U5.12 32.91,9.79 v32.77,9.78 | U3.12 v13.34,9.78 | U4.12 23.81,9.78 v22.86,9.78 | J3.6 31.24,1.78 31.24,8.64 v30.99,8.89
  Bottom 0.305: v41.91,9.78 33.78,9.78 v32.77,9.78 30.99,9.78 | 30.99,9.78 28.45,9.78 v22.86,9.78 19.18,9.78 v13.34,9.78 | v30.99,8.89 30.99,9.78

### Text on the board
tPlace: Capable Robot Components / Feather RTD Wing [XTMT] | RTD4
bPlace: VIN | 1 | 2 | 3 | 4 | 1 | Capable Robot Components / Feather RTD Wing [XTMT] | 2 | 3 | 4 | GND | SCLK | MOSI | MISO